# Altium project Capacitor VIAs - Board 03.PrjPcb
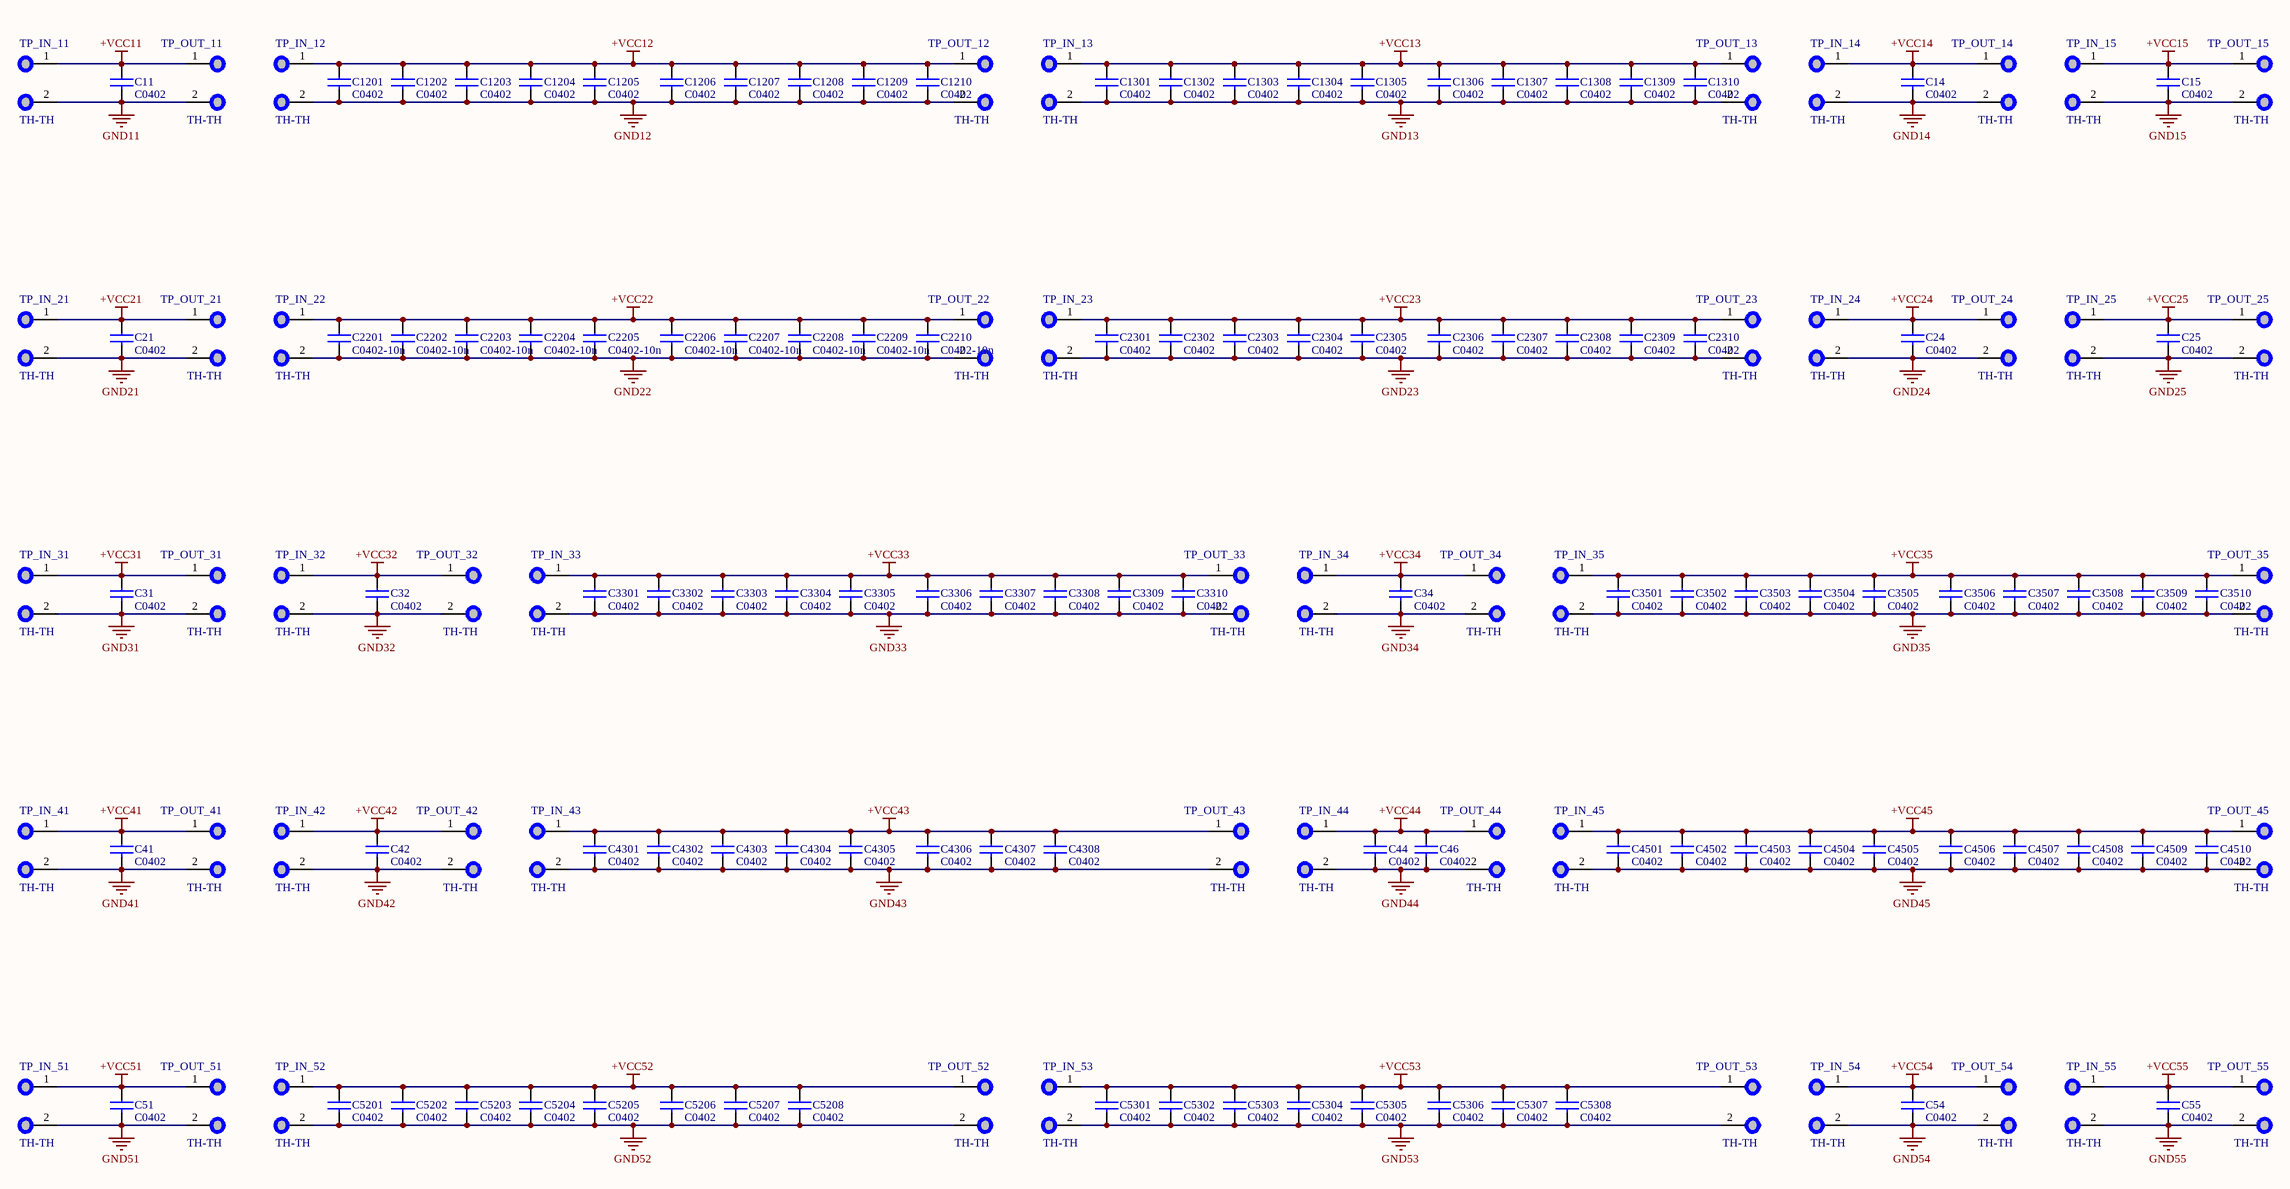
[diagram p0: Schematic.SchDoc]
1 sheet, 160 parts. Net scope: global (net labels, ports and power ports of the same name join across sheets).
Board file: PCB03.PcbDoc

## Sheet Schematic.SchDoc
size A2

### Parts
C11  C0402  [C0402]
C14  C0402  [C0402]
C15  C0402  [C0402]
C21  C0402  [C0402]
C24  C0402  [C0402]
C25  C0402  [C0402]
C31  C0402  [C0402]
C32  C0402  [C0402]
C34  C0402  [C0402]
C41  C0402  [C0402]
C42  C0402  [C0402]
C44  C0402  [C0402]
C46  C0402  [C0402]
C51  C0402  [C0402]
C54  C0402  [C0402]
C55  C0402  [C0402]
C1201  C0402  [C0402]
C1202  C0402  [C0402]
C1203  C0402  [C0402]
C1204  C0402  [C0402]
C1205  C0402  [C0402]
C1206  C0402  [C0402]
C1207  C0402  [C0402]
C1208  C0402  [C0402]
C1209  C0402  [C0402]
C1210  C0402  [C0402]
C1301  C0402  [C0402]
C1302  C0402  [C0402]
C1303  C0402  [C0402]
C1304  C0402  [C0402]
C1305  C0402  [C0402]
C1306  C0402  [C0402]
C1307  C0402  [C0402]
C1308  C0402  [C0402]
C1309  C0402  [C0402]
C1310  C0402  [C0402]
C2201  C0402-10n  [C0402]
C2202  C0402-10n  [C0402]
C2203  C0402-10n  [C0402]
C2204  C0402-10n  [C0402]
C2205  C0402-10n  [C0402]
C2206  C0402-10n  [C0402]
C2207  C0402-10n  [C0402]
C2208  C0402-10n  [C0402]
C2209  C0402-10n  [C0402]
C2210  C0402-10n  [C0402]
C2301  C0402  [C0402]
C2302  C0402  [C0402]
C2303  C0402  [C0402]
C2304  C0402  [C0402]
C2305  C0402  [C0402]
C2306  C0402  [C0402]
C2307  C0402  [C0402]
C2308  C0402  [C0402]
C2309  C0402  [C0402]
C2310  C0402  [C0402]
C3301  C0402  [C0402]
C3302  C0402  [C0402]
C3303  C0402  [C0402]
C3304  C0402  [C0402]
C3305  C0402  [C0402]
C3306  C0402  [C0402]
C3307  C0402  [C0402]
C3308  C0402  [C0402]
C3309  C0402  [C0402]
C3310  C0402  [C0402]
C3501  C0402  [C0402]
C3502  C0402  [C0402]
C3503  C0402  [C0402]
C3504  C0402  [C0402]
C3505  C0402  [C0402]
C3506  C0402  [C0402]
C3507  C0402  [C0402]
C3508  C0402  [C0402]
C3509  C0402  [C0402]
C3510  C0402  [C0402]
C4301  C0402  [C0402]
C4302  C0402  [C0402]
C4303  C0402  [C0402]
C4304  C0402  [C0402]
C4305  C0402  [C0402]
C4306  C0402  [C0402]
C4307  C0402  [C0402]
C4308  C0402  [C0402]
C4501  C0402  [C0402]
C4502  C0402  [C0402]
C4503  C0402  [C0402]
C4504  C0402  [C0402]
C4505  C0402  [C0402]
C4506  C0402  [C0402]
C4507  C0402  [C0402]
C4508  C0402  [C0402]
C4509  C0402  [C0402]
C4510  C0402  [C0402]
C5201  C0402  [C0402]
C5202  C0402  [C0402]
C5203  C0402  [C0402]
C5204  C0402  [C0402]
C5205  C0402  [C0402]
C5206  C0402  [C0402]
C5207  C0402  [C0402]
C5208  C0402  [C0402]
C5301  C0402  [C0402]
C5302  C0402  [C0402]
C5303  C0402  [C0402]
C5304  C0402  [C0402]
C5305  C0402  [C0402]
C5306  C0402  [C0402]
C5307  C0402  [C0402]
C5308  C0402  [C0402]
TP_IN_11  TH-TH  [TP_TH_TH]
TP_IN_12  TH-TH  [TP_TH_TH]
TP_IN_13  TH-TH  [TP_TH_TH]
TP_IN_14  TH-TH  [TP_TH_TH]
TP_IN_15  TH-TH  [TP_TH_TH]
TP_IN_21  TH-TH  [TP_TH_TH]
TP_IN_22  TH-TH  [TP_TH_TH]
TP_IN_23  TH-TH  [TP_TH_TH]
TP_IN_24  TH-TH  [TP_TH_TH]
TP_IN_25  TH-TH  [TP_TH_TH]
TP_IN_31  TH-TH  [TP_TH_TH]
TP_IN_32  TH-TH  [TP_TH_TH]
TP_IN_33  TH-TH  [TP_TH_TH]
TP_IN_34  TH-TH  [TP_TH_TH]
TP_IN_35  TH-TH  [TP_TH_TH]
TP_IN_41  TH-TH  [TP_TH_TH]
TP_IN_42  TH-TH  [TP_TH_TH]
TP_IN_43  TH-TH  [TP_TH_TH]
TP_IN_44  TH-TH  [TP_TH_TH]
TP_IN_45  TH-TH  [TP_TH_TH]
TP_IN_51  TH-TH  [TP_TH_TH]
TP_IN_52  TH-TH  [TP_TH_TH]
TP_IN_53  TH-TH  [TP_TH_TH]
TP_IN_54  TH-TH  [TP_TH_TH]
TP_IN_55  TH-TH  [TP_TH_TH]
TP_OUT_11  TH-TH  [TP_TH_TH]
TP_OUT_12  TH-TH  [TP_TH_TH]
TP_OUT_13  TH-TH  [TP_TH_TH]
TP_OUT_14  TH-TH  [TP_TH_TH]
TP_OUT_15  TH-TH  [TP_TH_TH]
TP_OUT_21  TH-TH  [TP_TH_TH]
TP_OUT_22  TH-TH  [TP_TH_TH]
TP_OUT_23  TH-TH  [TP_TH_TH]
TP_OUT_24  TH-TH  [TP_TH_TH]
TP_OUT_25  TH-TH  [TP_TH_TH]
TP_OUT_31  TH-TH  [TP_TH_TH]
TP_OUT_32  TH-TH  [TP_TH_TH]
TP_OUT_33  TH-TH  [TP_TH_TH]
TP_OUT_34  TH-TH  [TP_TH_TH]
TP_OUT_35  TH-TH  [TP_TH_TH]
TP_OUT_41  TH-TH  [TP_TH_TH]
TP_OUT_42  TH-TH  [TP_TH_TH]
TP_OUT_43  TH-TH  [TP_TH_TH]
TP_OUT_44  TH-TH  [TP_TH_TH]
TP_OUT_45  TH-TH  [TP_TH_TH]
TP_OUT_51  TH-TH  [TP_TH_TH]
TP_OUT_52  TH-TH  [TP_TH_TH]
TP_OUT_53  TH-TH  [TP_TH_TH]
TP_OUT_54  TH-TH  [TP_TH_TH]
TP_OUT_55  TH-TH  [TP_TH_TH]

### Nets
+VCC11: C11.1 TP_IN_11.1 TP_OUT_11.1
+VCC12: C1201.1 C1202.1 C1203.1 C1204.1 C1205.1 C1206.1 C1207.1 C1208.1 C1209.1 C1210.1 TP_IN_12.1 TP_OUT_12.1
+VCC13: C1301.1 C1302.1 C1303.1 C1304.1 C1305.1 C1306.1 C1307.1 C1308.1 C1309.1 C1310.1 TP_IN_13.1 TP_OUT_13.1
+VCC14: C14.1 TP_IN_14.1 TP_OUT_14.1
+VCC15: C15.1 TP_IN_15.1 TP_OUT_15.1
+VCC21: C21.1 TP_IN_21.1 TP_OUT_21.1
+VCC22: C2201.1 C2202.1 C2203.1 C2204.1 C2205.1 C2206.1 C2207.1 C2208.1 C2209.1 C2210.1 TP_IN_22.1 TP_OUT_22.1
+VCC23: C2301.1 C2302.1 C2303.1 C2304.1 C2305.1 C2306.1 C2307.1 C2308.1 C2309.1 C2310.1 TP_IN_23.1 TP_OUT_23.1
+VCC24: C24.1 TP_IN_24.1 TP_OUT_24.1
+VCC25: C25.1 TP_IN_25.1 TP_OUT_25.1
+VCC31: C31.1 TP_IN_31.1 TP_OUT_31.1
+VCC32: C32.1 TP_IN_32.1 TP_OUT_32.1
+VCC33: C3301.1 C3302.1 C3303.1 C3304.1 C3305.1 C3306.1 C3307.1 C3308.1 C3309.1 C3310.1 TP_IN_33.1 TP_OUT_33.1
+VCC34: C34.1 TP_IN_34.1 TP_OUT_34.1
+VCC35: C3501.1 C3502.1 C3503.1 C3504.1 C3505.1 C3506.1 C3507.1 C3508.1 C3509.1 C3510.1 TP_IN_35.1 TP_OUT_35.1
+VCC41: C41.1 TP_IN_41.1 TP_OUT_41.1
+VCC42: C42.1 TP_IN_42.1 TP_OUT_42.1
+VCC43: C4301.1 C4302.1 C4303.1 C4304.1 C4305.1 C4306.1 C4307.1 C4308.1 TP_IN_43.1 TP_OUT_43.1
+VCC44: C44.1 C46.1 TP_IN_44.1 TP_OUT_44.1
+VCC45: C4501.1 C4502.1 C4503.1 C4504.1 C4505.1 C4506.1 C4507.1 C4508.1 C4509.1 C4510.1 TP_IN_45.1 TP_OUT_45.1
+VCC51: C51.1 TP_IN_51.1 TP_OUT_51.1
+VCC52: C5201.1 C5202.1 C5203.1 C5204.1 C5205.1 C5206.1 C5207.1 C5208.1 TP_IN_52.1 TP_OUT_52.1
+VCC53: C5301.1 C5302.1 C5303.1 C5304.1 C5305.1 C5306.1 C5307.1 C5308.1 TP_IN_53.1 TP_OUT_53.1
+VCC54: C54.1 TP_IN_54.1 TP_OUT_54.1
+VCC55: C55.1 TP_IN_55.1 TP_OUT_55.1
GND11: C11.2 TP_IN_11.2 TP_OUT_11.2
GND12: C1201.2 C1202.2 C1203.2 C1204.2 C1205.2 C1206.2 C1207.2 C1208.2 C1209.2 C1210.2 TP_IN_12.2 TP_OUT_12.2
GND13: C1301.2 C1302.2 C1303.2 C1304.2 C1305.2 C1306.2 C1307.2 C1308.2 C1309.2 C1310.2 TP_IN_13.2 TP_OUT_13.2
GND14: C14.2 TP_IN_14.2 TP_OUT_14.2
GND15: C15.2 TP_IN_15.2 TP_OUT_15.2
GND21: C21.2 TP_IN_21.2 TP_OUT_21.2
GND22: C2201.2 C2202.2 C2203.2 C2204.2 C2205.2 C2206.2 C2207.2 C2208.2 C2209.2 C2210.2 TP_IN_22.2 TP_OUT_22.2
GND23: C2301.2 C2302.2 C2303.2 C2304.2 C2305.2 C2306.2 C2307.2 C2308.2 C2309.2 C2310.2 TP_IN_23.2 TP_OUT_23.2
GND24: C24.2 TP_IN_24.2 TP_OUT_24.2
GND25: C25.2 TP_IN_25.2 TP_OUT_25.2
GND31: C31.2 TP_IN_31.2 TP_OUT_31.2
GND32: C32.2 TP_IN_32.2 TP_OUT_32.2
GND33: C3301.2 C3302.2 C3303.2 C3304.2 C3305.2 C3306.2 C3307.2 C3308.2 C3309.2 C3310.2 TP_IN_33.2 TP_OUT_33.2
GND34: C34.2 TP_IN_34.2 TP_OUT_34.2
GND35: C3501.2 C3502.2 C3503.2 C3504.2 C3505.2 C3506.2 C3507.2 C3508.2 C3509.2 C3510.2 TP_IN_35.2 TP_OUT_35.2
GND41: C41.2 TP_IN_41.2 TP_OUT_41.2
GND42: C42.2 TP_IN_42.2 TP_OUT_42.2
GND43: C4301.2 C4302.2 C4303.2 C4304.2 C4305.2 C4306.2 C4307.2 C4308.2 TP_IN_43.2 TP_OUT_43.2
GND44: C44.2 C46.2 TP_IN_44.2 TP_OUT_44.2
GND45: C4501.2 C4502.2 C4503.2 C4504.2 C4505.2 C4506.2 C4507.2 C4508.2 C4509.2 C4510.2 TP_IN_45.2 TP_OUT_45.2
GND51: C51.2 TP_IN_51.2 TP_OUT_51.2
GND52: C5201.2 C5202.2 C5203.2 C5204.2 C5205.2 C5206.2 C5207.2 C5208.2 TP_IN_52.2 TP_OUT_52.2
GND53: C5301.2 C5302.2 C5303.2 C5304.2 C5305.2 C5306.2 C5307.2 C5308.2 TP_IN_53.2 TP_OUT_53.2
GND54: C54.2 TP_IN_54.2 TP_OUT_54.2
GND55: C55.2 TP_IN_55.2 TP_OUT_55.2

### Library data of the parts
C11 C14 C15 C21 C24 C25 C31 C32 C34 C41 C42 C44 C46 C51 C54 C55 C1201-C1210 C1301-C1310 C2201-C2210 C2301-C2310 C3301-C3310 C3501-C3510 C4301-C4308 C4501-C4510 C5201-C5208 C5301-C5308 = CAP0402
TP_IN_11-TP_IN_15 TP_IN_21-TP_IN_25 TP_IN_31-TP_IN_35 TP_IN_41-TP_IN_45 TP_IN_51-TP_IN_55 TP_OUT_11-TP_OUT_15 TP_OUT_21-TP_OUT_25 TP_OUT_31-TP_OUT_35 TP_OUT_41-TP_OUT_45 TP_OUT_51-TP_OUT_55 = TP_TH_TH: Testpoints TH - TH 1mm/0.3mm